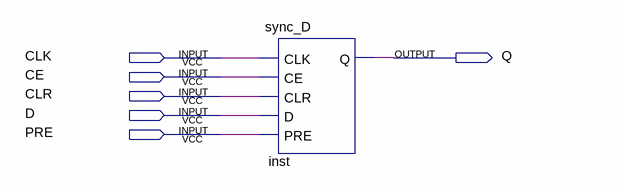
[diagram p0: schematic sheet]
// Quartus schematic Block1.bdf as structural Verilog: 1 symbols, 6 pins
module Block1 (
  input  CLK,
  input  CE,
  input  CLR,
  input  D,
  input  PRE,
  output Q
);

  sync_D inst (.CLK(CLK), .CE(CE), .CLR(CLR), .D(D), .PRE(PRE), .Q(Q));
endmodule
